# Altium schematic sheet MPU6500 accelerometer.SchDoc
size A4; SheetNumber: 6; SheetTotal: 12
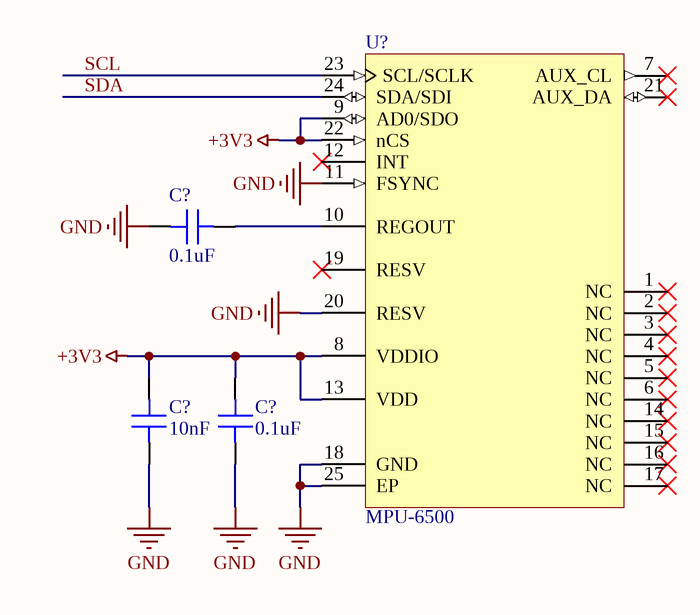
[diagram p0: MPU6500 accelerometer.SchDoc]

## Parts
(Parts that share a designator on the sheet are numbered #1, #2 ... from top to bottom, then left to right.)
C?#1  0.1uF  [CAPC1005X06N]
C?#2  10nF  [CAPC1005X06N]
C?#3  0.1uF  [CAPC1005X06N]
U?  MPU-6500  [QFN40P300X300X95_HS-25N]

## Nets
+3V3: C?#2.2 C?#3.2 U?.8(VDDIO) U?.9(AD0/SDO) U?.13(VDD) U?.22(nCS)
GND: C?#1.1 C?#2.1 C?#3.1 U?.11(FSYNC) U?.18(GND) U?.20(RESV) U?.25(EP)
SCL: U?.23(SCL/SCLK)
SDA: U?.24(SDA/SDI)
NetC?#1_2: C?#1.2 U?.10(REGOUT)

Not connected (* = marked no-connect by the designer): U? 1(NC)* 2(NC)* 3(NC)* 4(NC)* 5(NC)* 6(NC)* 7(AUX_CL)* 12(INT)* 14(NC)* 15(NC)* 16(NC)* 17(NC)* 19(RESV)* 21(AUX_DA)*

## Library data of the parts
C?#1 C?#3 = 0402B104K500CT: Manufacturer: Walsin Tech Corp; Voltage: 50V; Tolerance: 10%; Dielectric: X7R; Min Temperature: -55; Max Temperature: 125; PartNumber: 0402B104K500CT; ComponentLink1URL: https://datasheet.lcsc.com/lcsc/1810191621_Walsin-Tech-Corp-0402B104K500CT_C152814.pdf; ComponentLink1Description: Datasheet; Package: 0402; Part Status: Active; Capacitance: 0.1uF
C?#2 = 0402B103K500NT: Manufacturer: FH (Guangdong Fenghua Advanced Tech); Voltage: 50V; Tolerance: 10%; Dielectric: X7R; Min Temperature: -55; Max Temperature: 125; PartNumber: 0402B103K500NT; ComponentLink1URL: https://datasheet.lcsc.com/lcsc/1811141843_FH--Guangdong-Fenghua-Advanced-Tech-0402B103K500NT_C1524.pdf; ComponentLink1Description: Datasheet; Package: 0402; Part Status: Active; Capacitance: 10nF
U? = MPU-6500: Manufacturer: TDK; PartNumber: MPU-6500; ComponentLink1URL: https://invensense.tdk.com/wp-content/uploads/2020/06/PS-MPU-6500A-01-v1.3.pdf; ComponentLink1Description: Datasheet; ComponentLink2URL: https://invensense.tdk.com/wp-content/uploads/2015/02/MPU-6500-Register-Map2.pdf; ComponentLink2Description: Register Maps; ComponentLink3URL: User Guides; ComponentLink3Description: https://invensense.tdk.com/wp-content/uploads/2017/06/AN-IVS-0001EVB-00-v1.4.pdf; Package: QFN-24EP; Part Status: Active